# Altium schematic sheet 05-Alarm.SchDoc
size A4
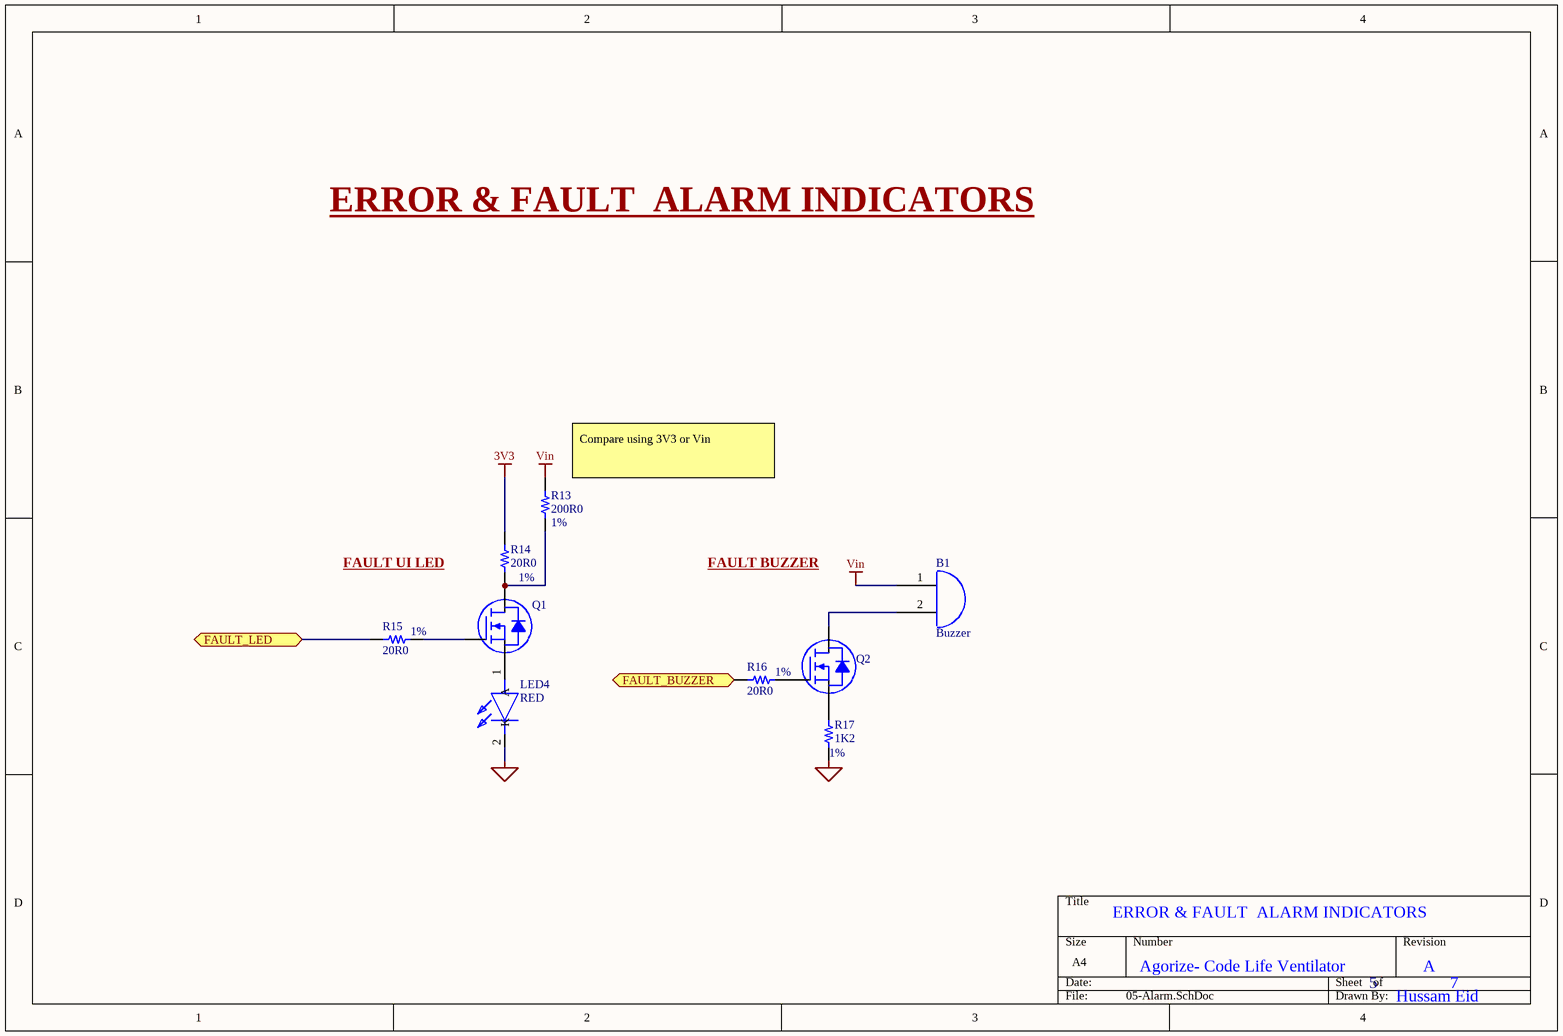
[diagram p0: 05-Alarm.SchDoc]

## Parts
B1  Buzzer  [Buzzer]
LED4  RED  [QBHP686IWKCW]
Q1  (no value)  [SOTFL50P160X70-3N]
Q2  (no value)  [SOTFL50P160X70-3N]
R13  200R0  Tolerance: 1%  [RES 1206/3216]
R14  20R0  Tolerance: 1%  [RES 1206/3216]
R15  20R0  Tolerance: 1%  [RES 1206/3216]
R16  20R0  Tolerance: 1%  [RES 1206/3216]
R17  1K2  Tolerance: 1%  [RES 1206/3216]

## Ports
FAULT_BUZZER (bidir), FAULT_LED (bidir)

## Nets
3V3: R14.2
COM: LED4.2(K) R17.2
Vin: B1.1 R13.2
FAULT_BUZZER: R16.2 ; port FAULT_BUZZER
FAULT_LED: R15.2 ; port FAULT_LED
NetB1_2: B1.2 Q2.3(D)
NetLED4_1: LED4.1(A) Q1.1(S)
NetQ1_2: Q1.2(G) R15.1
NetQ1_3: Q1.3(D) R13.1 R14.1
NetQ2_1: Q2.1(S) R17.1
NetQ2_2: Q2.2(G) R16.1

## Notes on the sheet
- ERROR & FAULT  ALARM INDICATORS
- (near R13) Compare using 3V3 or Vin
- FAULT UI LED
- FAULT BUZZER
- Agorize- Code Life Ventilator
- 5
- A
- 7
- Hussam Eid

## Library data of the parts
B1 = Buzzer: BUZZER, 16.5 MM, 6.7 MM DEEP, P,; Manufacturer 1: CUI; Manufacturer Part Number 1: CPT-1667-85T; Supplier 1: Digi-Key; Supplier Part Number 1: 102-CPT-1667-85T-ND; RoHS 1: No; Stock 1: 494; Pricing 1: 1 = 0.82000, 10 = 0.68400, 25 = 0.63360, 50 = 0.59680, 100 = 0.56130, 500 = 0.48384, 1000 = 0.45266, 5000 = 0.42900 (USD)
LED4 = QBHP686-IWK-CW: Red 620nm LED Indication - Discrete 2.4V 1113 (2835 Metric); Manufacturer 1: QT-Brightek; Manufacturer Part Number 1: QBHP686-RH; Lens Color: Colorless; Lens Style: Flat; Lens Transparency: Clear; Test Current: 150mA; Viewing Angle: 120°; Supplier 1: Digi-Key; Supplier Part Number 1: 1516-1369-1-ND; RoHS 1: No; Stock 1: 3690; Pricing 1: 1 = 0.85000, 10 = 0.66200, 100 = 0.42530, 500 = 0.35910, 1000 = 0.28350 (USD); Mount: Surface Mount; Case/Package: 1113; Color: Red; Case Code (Imperial): 1113; Packaging: Tape and Reel; Forward Voltage: 2.4V; Dominant Wavelength: 620nm; Length: 3.1mm; Height: 1mm; Width: 2.8mm; ComponentLink1URL: http://www.qt-brightek.com/datasheet/QBHP686-XXH Series.pdf?src-supplier=Digi-Key; ComponentLink1Description: http://www.qt-brightek.com/datasheet/QBHP686-XXH Series.pdf?src-supplier=Digi-Key
Q1 Q2 = 2N7002,215: MOSFET N-CH 60V 300MA SOT-23; Manufacturer 1: Rohm; Manufacturer Part Number 1: RYE002N05TCL; Description 1: MOSFET N-CH 50V 0.2A EMT3; Drain to Source Voltage (Vdss): 50V; Continuous Drain Current (ID): 200mA; Rds On Max: 2.2R; Input Capacitance: 26pF; Max Power Dissipation: 150mW; ComponentLink1Description: Datasheet; ComponentLink1URL: http://www.nxp.com/documents/data_sheet/2N7002.pdf; ComponentLink2Description: Digi-Key Listing; ComponentLink2URL: http://www.digikey.com/product-detail/en/2N7002,215/568-1369-2-ND/762973; Supplier 1: Digi-Key; Supplier Part Number 1: RYE002N05TCLCT-ND; RoHS 1: Yes; Stock 1: 5369; Pricing 1: 1 = 0.20000, 10 = 0.16300, 25 = 0.13680, 100 = 0.08660, 250 = 0.06688, 500 = 0.05700, 1000 = 0.03876 (USD); Mount: Surface Mount; Packaging: Tape and Reel; Lead Free: Lead Free; ComponentLink3URL: http://www.mouser.com/ds/2/348/rye002n05-515252.pdf?src-supplier=Mouser; ComponentLink3Description: http://www.mouser.com/ds/2/348/rye002n05-515252.pdf?src-supplier=Mouser; ComponentLink4URL: https://www.rohm.com/datasheet/RYE002N05?src-supplier=Digi-Key; ComponentLink4Description: https://www.rohm.com/datasheet/RYE002N05?src-supplier=Digi-Key; ComponentLink5URL: http://www.rohm.com/web/global/datasheet/RYE002N05?src-supplier=Digi-Key; ComponentLink5Description: http://www.rohm.com/web/global/datasheet/RYE002N05?src-supplier=Digi-Key; ComponentLink6URL: http://rohmfs.rohm.com/en/products/databook/datasheet/discrete/transistor/mosfet/rye002n05.pdf?src-supplier=Avnet; ComponentLink6Description: http://rohmfs.rohm.com/en/products/databook/datasheet/discrete/transistor/mosfet/rye002n05.pdf?src-supplier=Avnet
R13 = ERJ-8ENF1002V: RES SMD 10K OHM 1% 1/4W 1206; Manufacturer 1: Yageo; Manufacturer Part Number 1: RC1206FR-07200RL; Description 1: Res Thick Film 1206 200 Ohm 1% 0.25W(1/4W) ±100ppm/C Molded SMD Paper T/R; Temperature Coefficient: 100ppm/°C; Resistance: 200R; Voltage Rating (DC): 200V; Power Rating: 250mW; ComponentLink1Description: Datasheet; ComponentLink1URL: http://industrial.panasonic.com/www-cgi/jvcr13pz.cgi?E+PZ+3+AOA0002+ERJ8ENF1002V+7+WW; ComponentLink2Description: Digi-Key listing; ComponentLink2URL: http://digikey.com/product-detail/en/ERJ-8ENF1002V/P10.0KFTR-ND/89059; Supplier 1: Digi-Key; Supplier Part Number 1: 311-200FRCT-ND; RoHS 1: Yes; Stock 1: 2870115; Pricing 1: 1 = 0.10000, 10 = 0.07100, 100 = 0.02910, 1000 = 0.01306, 2500 = 0.01134 (USD); Mount: Surface Mount; Case/Package: 1206; Weight: 0.000571oz; Case Code (Metric): 3216; Case Code (Imperial): 1206; Min Operating Temperature: -55°C; Max Operating Temperature: 155°C; Composition: Thick Film; Packaging: Tape and Reel; Termination: SMD/SMT; Military Standard: Not; Voltage Rating: 200V; Length: 3.1mm; Height: 0.55mm; Width: 1.6mm; Depth: 1.6mm; Lead Free: Lead Free; ComponentLink3URL: https://datasheet.ciiva.com/11808/0900766b80c6630a-11808603.pdf?src-supplier=RSComponents; ComponentLink3Description: https://datasheet.ciiva.com/11808/0900766b80c6630a-11808603.pdf?src-supplier=RSComponents
R14-R16 = ERJ-8ENF10R0V: RES 20 OHM 1% 1/2W 1206; Manufacturer 1: Stackpole Electronics; Manufacturer Part Number 1: RNCP1206FTD20R0; Description 1: RES SMD 20 OHM 1% 1/2W 1206; Max Power Dissipation: 500mW; Temperature Coefficient: 100ppm/°C; Resistance: 20R; ComponentLink1Description: Datasheet; ComponentLink1URL: http://industrial.panasonic.com/www-cgi/jvcr13pz.cgi?E+PZ+3+AOA0002+ERJ8ENF10R0V+7+WW; ComponentLink2Description: Digi-Key listing; ComponentLink2URL: http://digikey.com/product-detail/en/ERJ-8ENF10R0V/P10.0FTR-ND/88239; Supplier 1: Digi-Key; Supplier Part Number 1: RNCP1206FTD20R0CT-ND; RoHS 1: Yes; Stock 1: 55462; Pricing 1: 1 = 0.10000, 10 = 0.08900, 100 = 0.03410, 1000 = 0.01500, 2500 = 0.01296 (USD); Mount: Surface Mount; Case/Package: 1206; Case Code (Metric): 3216; Case Code (Imperial): 1206; Min Operating Temperature: -55°C; Max Operating Temperature: 155°C; Number of Terminations: 2; Features: Moisture Resistant,Anti-Sulfur; Packaging: Tape and Reel; Composition: Thin Film; Length: 0.122inch; Height: 0.024inch; Width: 0.059inch; Lead Free: Lead Free; ComponentLink3URL: http://www.seielect.com/Catalog/SEI-rncp.pdf?src-supplier=Digi-Key; ComponentLink3Description: http://www.seielect.com/Catalog/SEI-rncp.pdf?src-supplier=Digi-Key; ComponentLink4URL: https://www.seielect.com/catalog/SEI-Packaging.pdf?src-supplier=Digi-Key; ComponentLink4Description: https://www.seielect.com/catalog/SEI-Packaging.pdf?src-supplier=Digi-Key
R17 = ERJ-8ENF10R0V: RES SMD 1.2K OHM 1% 1/4W 1206; Manufacturer 1: Yageo; Manufacturer Part Number 1: RC1206FR-071K2L; Temperature Coefficient: 100ppm/°C; Resistance: 1.2kR; Power Rating: 250mW; Working Voltage: 200V; ComponentLink1Description: Datasheet; ComponentLink1URL: http://industrial.panasonic.com/www-cgi/jvcr13pz.cgi?E+PZ+3+AOA0002+ERJ8ENF10R0V+7+WW; ComponentLink2Description: Digi-Key listing; ComponentLink2URL: http://digikey.com/product-detail/en/ERJ-8ENF10R0V/P10.0FTR-ND/88239; ComponentLink3URL: http://www.seielect.com/Catalog/SEI-rncp.pdf?src-supplier=Digi-Key; ComponentLink3Description: http://www.seielect.com/Catalog/SEI-rncp.pdf?src-supplier=Digi-Key; ComponentLink4URL: https://www.seielect.com/catalog/SEI-Packaging.pdf?src-supplier=Digi-Key; ComponentLink4Description: https://www.seielect.com/catalog/SEI-Packaging.pdf?src-supplier=Digi-Key; Supplier 1: Digi-Key; Supplier Part Number 1: 311-1.20KFRCT-ND; RoHS 1: Yes; Description 1: RES SMD 1.2K OHM 1% 1/4W 1206; Stock 1: 670082; Pricing 1: 1 = 0.10000, 10 = 0.07100, 100 = 0.02910, 1000 = 0.01306, 2500 = 0.01134 (USD); Case/Package: 1206; Case Code (Metric): 3216; Case Code (Imperial): 1206; Min Operating Temperature: -55°C; Max Operating Temperature: 155°C; Packaging: Tape and Reel; Features: Moisture Resistant; Max Power Dissipation: 250mW; Composition: Thick Film; Number of Terminations: 2; Termination: SMD/SMT; Military Standard: Not; Voltage Rating: 200V; Package Quantity: 1; Length: 3.1mm; Height: 0.026inch; Depth: 1.6mm; Width: 0.063inch; Lead Free: Lead Free; REACH SVHC: Unknown; ComponentLink5URL: https://datasheet.ciiva.com/7857/444357-7857274.pdf?src-supplier=Element14; ComponentLink5Description: https://datasheet.ciiva.com/7857/444357-7857274.pdf?src-supplier=Element14; ComponentLink6URL: https://datasheet.ciiva.com/7857/444357-7857275.pdf?src-supplier=Element14; ComponentLink6Description: https://datasheet.ciiva.com/7857/444357-7857275.pdf?src-supplier=Element14; ComponentLink7URL: https://datasheet.ciiva.com/2460/pyu-rc1206-51-rohs-l-4-2460285.pdf?src-supplier=Digi-Key; ComponentLink7Description: https://datasheet.ciiva.com/2460/pyu-rc1206-51-rohs-l-4-2460285.pdf?src-supplier=Digi-Key; ComponentLink8URL: https://datasheet.ciiva.com/2460/pyu-rc1206-51-rohs-l-4-2460286.pdf?src-supplier=Digi-Key; ComponentLink8Description: https://datasheet.ciiva.com/2460/pyu-rc1206-51-rohs-l-4-2460286.pdf?src-supplier=Digi-Key; ComponentLink9URL: https://datasheet.ciiva.com/2460/pyu-rc1206-51-rohs-l-4-2460287.pdf?src-supplier=Digi-Key; ComponentLink9Description: https://datasheet.ciiva.com/2460/pyu-rc1206-51-rohs-l-4-2460287.pdf?src-supplier=Digi-Key